# Altium schematic sheet [3]Sensors.SchDoc
size A4
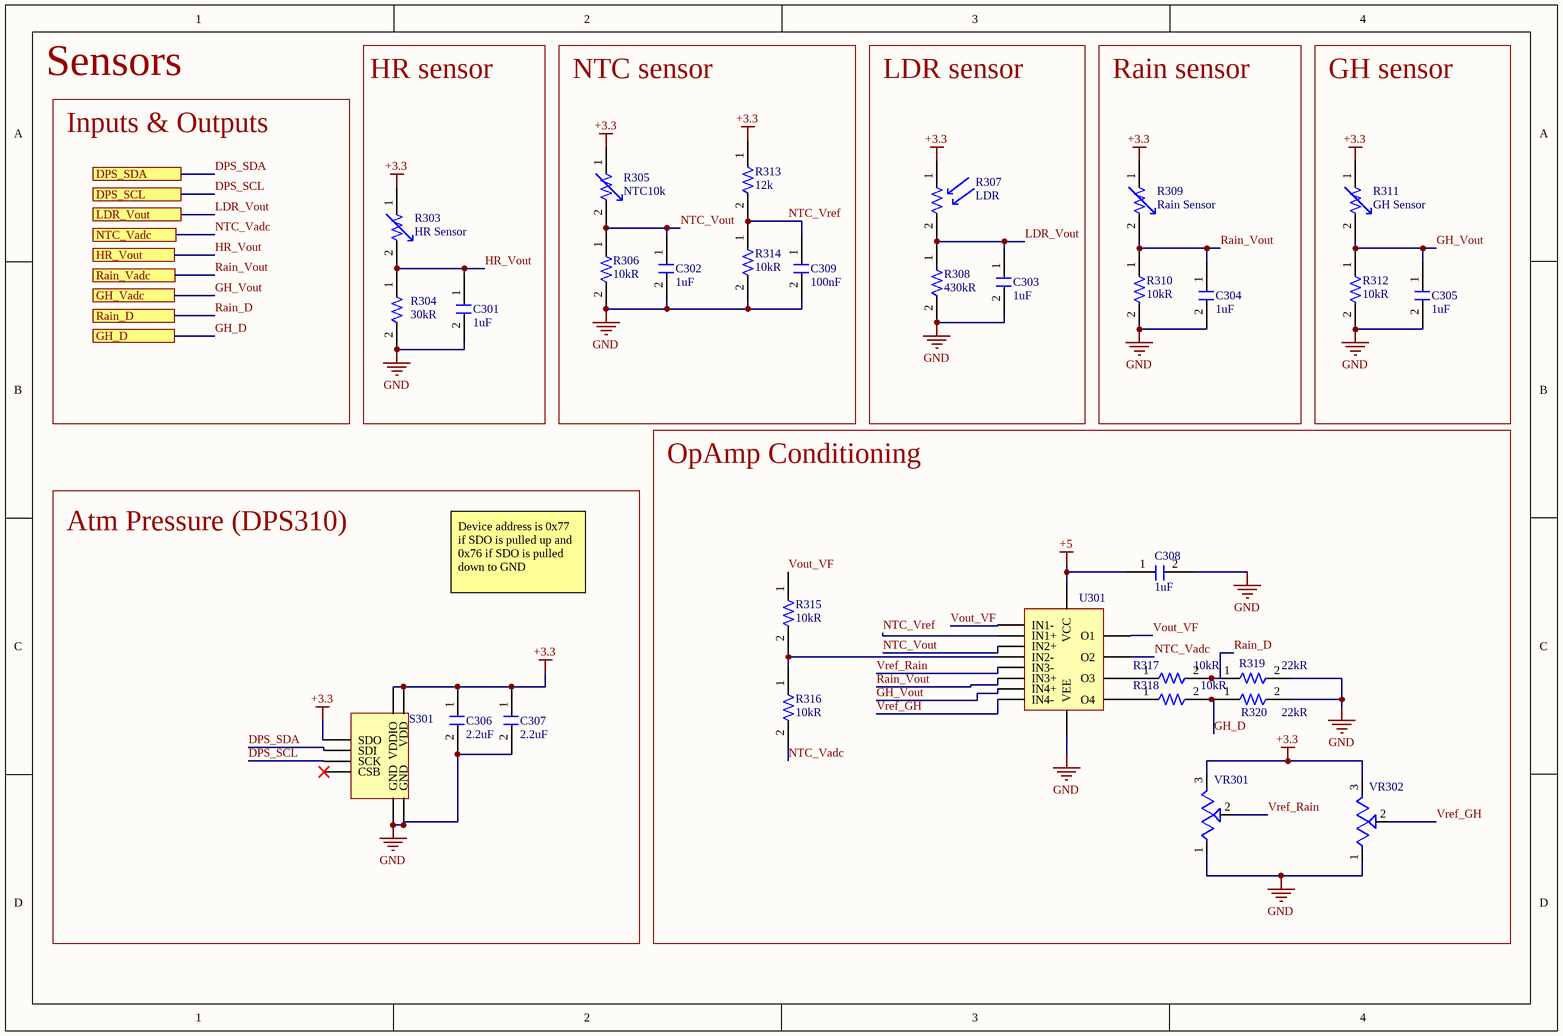
[diagram p0: [3]Sensors.SchDoc]

## Parts
C301  Capacitance: 1uF  [C1206FNPC-RW]  (hidden comment: 885012208036)
C302  Capacitance: 1uF  [C1206FNPC-RW]  (hidden comment: 885012208036)
C303  Capacitance: 1uF  [C1206FNPC-RW]  (hidden comment: 885012208036)
C304  Capacitance: 1uF  [C1206FNPC-RW]  (hidden comment: 885012208036)
C305  Capacitance: 1uF  [C1206FNPC-RW]  (hidden comment: 885012208036)
C306  2.2uF  [C0805FNPC-W]
C307  2.2uF  [C0805FNPC-W]
C308  Capacitance: 1uF  [C1206FNPC-RW]  (hidden comment: 885012208036)
C309  Capacitance: 100nF  [C1206FNPC-RW]  (hidden comment: 885012208009)
R303  HR Sensor  [HR_Sensor]
R304  Resistance: 30kR  [R1206FTK-W]  (hidden comment: CRCW120630K0FKEA)
R305  NTC10k  [NTC10k_0805]
R306  Resistance: 10kR  [R0805FTK]  (hidden comment: CR0805-JW-103ELF)
R307  LDR  [HR_Sensor]
R308  430kR  [R0805FTK]
R309  Rain Sensor  [EXTERNAL_SENSOR]
R310  Resistance: 10kR  [R0805FTK]  (hidden comment: CR0805-JW-103ELF)
R311  GH Sensor  [EXTERNAL_SENSOR]
R312  Resistance: 10kR  [R0805FTK]  (hidden comment: CR0805-JW-103ELF)
R313  12k  [R1206]
R314  Resistance: 10kR  [R0805FTK]  (hidden comment: CR0805-JW-103ELF)
R315  Resistance: 10kR  [R0805FTK]  (hidden comment: CR0805-JW-103ELF)
R316  Resistance: 10kR  [R0805FTK]  (hidden comment: CR0805-JW-103ELF)
R317  Resistance: 10kR  [R0805FTK]  (hidden comment: CR0805-JW-103ELF)
R318  Resistance: 10kR  [R0805FTK]  (hidden comment: CR0805-JW-103ELF)
R319  22kR  [R0805FTK]
R320  22kR  [R0805FTK]
S301  DPS310XTSA1  [XDCR_DPS310XTSA1]  (value not drawn)
U301  OpAmp  [LM324_OpAmp]  (value not drawn)
VR301  Trimmer_10k_THT  [TRIM_3362P-1-103LF]  (value not drawn)
VR302  Trimmer_10k_THT  [TRIM_3362P-1-103LF]  (value not drawn)

## Blocks framed on the sheet
HR sensor: C301 R303 R304
NTC sensor: C302 C309 R305 R306 R313 R314
LDR sensor: C303 R307 R308
Rain sensor: C304 R309 R310
GH sensor: C305 R311 R312
OpAmp Conditioning: C308 R315-R320 U301 VR301 VR302
Atm Pressure (DPS310): C306 C307 S301

## Ports
DPS_SCL, DPS_SDA, GH_D, GH_Vadc, HR_Vout, LDR_Vout, NTC_Vadc, Rain_D, Rain_Vadc

## Nets
+3.3: C306.1 C307.1 R303.1 R305.1 R307.1 R309.1 R311.1 R313.1 S301.5(SDO) S301.6(VDDIO) S301.8(VDD) VR301.3(CW) VR302.3(CW)
+5: C308.1 U301.4(VCC)
GND: C301.2 C302.2 C303.2 C304.2 C305.2 C306.2 C307.2 C308.2 C309.2 R304.2 R306.2 R308.2 R310.2 R312.2 R314.2 R319.2 R320.2 S301.1(GND) S301.7(GND) U301.11(VEE) VR301.1(CCW) VR302.1(CCW)
DPS_SCL: S301.4(SCK) ; port DPS_SCL
DPS_SDA: S301.3(SDI) ; port DPS_SDA
GH_D: R318.2 R320.1 ; port GH_D
GH_Vout: C305.1 R311.2 R312.1 U301.12(IN4+) ; port GH_Vadc
HR_Vout: C301.1 R303.2 R304.1 ; port HR_Vout
LDR_Vout: C303.1 R307.2 R308.1 ; port LDR_Vout
NTC_Vadc: R316.2 U301.7(O2) ; port NTC_Vadc
NTC_Vout: C302.1 R305.2 R306.1 U301.5(IN2+)
NTC_Vref: C309.1 R313.2 R314.1 U301.3(IN1+)
Rain_D: R317.2 R319.1 ; port Rain_D
Rain_Vout: C304.1 R309.2 R310.1 U301.10(IN3+) ; port Rain_Vadc
Vout_VF: R315.1 U301.1(O1) U301.2(IN1-)
Vref_GH: U301.13(IN4-) VR302.2(WIPER)
Vref_Rain: U301.9(IN3-) VR301.2(WIPER)
NetR315_2: R315.2 R316.1 U301.6(IN2-)
NetR317_1: R317.1 U301.8(O3)
NetR318_1: R318.1 U301.14(O4)

Not connected (* = marked no-connect by the designer): S301 2(CSB)*

## Notes on the sheet
- Sensors
- Inputs & Outputs
- Device address is 0x77 if SDO is pulled up and 0x76 if SDO is pulled down to GND

## Library data of the parts
C301-C305 C308 = C1u-16V-1206FNPC-X7R: Cap Cer 1UF 16V X7R 1206; Manufacturer: Wurth Electronics; Tolerance: 10%; .Creator: GP; Category: Capacitor; ComponentLink1Description: Datasheet; ComponentLink1URL: https://www.we-online.com/catalog/datasheet/885012208036.pdf; ComponentLink2Description: Where buy it; ComponentLink2URL: https://www.we-online.com/catalog/en/WCAP-CSGP-16VDC#885012208036; Supplier 1: Mouser; Manufacturer Part Number: 885012208036; RoHS: Yes; Stock 1: 5938; Pricing 1: 1=0,15000, 10=0,13900, 50=0,13900, 100=0,12400, 500=0,11000, 1000=0,11000, 3000=0,09100, 10000=0,09100 (USD); Mount: Surface Mount; Case/Package: 1206; Case Code (Metric): 3216; Case Code (Imperial): 1206; Min Operating Temperature: -55°C; Max Operating Temperature: 125°C; Packaging: Tape and Reel; Voltage Rating: 16V; Length: 0.126inch; Width: 0.063inch; Thickness: 0.051inch; RoHS Compliant: Yes; Supplier Part Number 1: 710-885012208036
C306 C307 = C2.2u-16V-0805FTK
C309 = C100n-10V-1206FNPC-X7R: Cap, 0.1ΜF, 10V, 10%, X7R, 1206; Manufacturer 1: Wurth Electronics; .Creator: GP; Supplier 1: Digi-Key; Manufacturer Part Number 1: 885012208009; RoHS: Yes; Category: Ceramic Capacitors; Stock 1: 7198; Pricing 1: 1=0,11000, 10=0,10300, 100=0,09200, 500=0,08100 (USD); Mount: Surface Mount; Case/Package: 1206; Case Code (Metric): 3216; Case Code (Imperial): 1206; Min Operating Temperature: -55°C; Max Operating Temperature: 125°C; Packaging: Tape and Reel; Voltage Rating: 10V; Tolerance: 10%; Length: 0.126inch; Width: 0.063inch; Thickness: 0.035inch; RoHS Compliant: Yes; ComponentLink1URL: http://www.farnell.com/datasheets/2031891.pdf?src-supplier=Farnell; ComponentLink1Description: http://www.farnell.com/datasheets/2031891.pdf?src-supplier=Farnell; ComponentLink2URL: http://katalog.we-online.de/pbs/datasheet/885012208009.pdf?src-supplier=Digi-Key; ComponentLink2Description: http://katalog.we-online.de/pbs/datasheet/885012208009.pdf?src-supplier=Digi-Key; ComponentLink3URL: https://katalog.we-online.de/pbs/datasheet/885012208009.pdf?src-supplier=Digi-Key; ComponentLink3Description: https://katalog.we-online.de/pbs/datasheet/885012208009.pdf?src-supplier=Digi-Key; Supplier Part Number 1: 732-8086-1-ND; ComponentLink4Description: Wurth Elektronik; ComponentLink4URL: https://www.we-online.com/catalog/en/WCAP-CSGP-10VDC?sq=885012208009#885012208009
R303 = Resistive_HR_Sensor: Resistive HR Sensor. R30k at 60%@25ºC
R304 = R30k-1206FTK: Res Thick Film 1206 30K Ohm 1% 1/4W ±100ppm/°C Molded SMD SMD Paper T/R; Manufacturer: Vishay; Power Rating: 250mW; Voltage Rating: 200V; .Creator: GP; Category: Resistor; ComponentLink1Description: Datasheet; ComponentLink1URL: https://docs.rs-online.com/bca8/A700000006404581.pdf; ComponentLink2Description: Where buy it; ComponentLink2URL: https://es.rs-online.com/web/p/resistencias-de-montaje-en-superficie/6792039; Supplier 1: RSComponents; Manufacturer Part Number: CRCW120630K0FKEA; RoHS: Yes; Stock 1: 3550; Pricing 1: 50=0,12000, 500=0,11200, 1000=0,10400, 2000=0,09700, 4000=0,08900 (USD); Case/Package: 1206; Number of Pins: 2; Contact Plating: Tin; Case Code (Imperial): 1206; Case Code (Metric): 3216; Weight: 0.000353oz; Size Code: 1206; Min Operating Temperature: -55°C; Max Operating Temperature: 155°C; Tolerance: 1%; Resistor Type: Thick Film; Packaging: Tape and Reel; Temperature Coefficient: 100ppm/°C; Package Quantity: 10; Termination: SMD/SMT; Number of Terminations: 2; Max Power Dissipation: 250mW; Features: Automotive AEC-Q200; Series: CRCW; Construction: Rectangular; Resistance Tolerance: 1%; Technology: THICK FILM; Length: 3.2mm; Width: 1.6mm; Height: 0.55mm; Depth: 1.6mm; Radiation Hardening: No; RoHS Compliant: Yes; REACH SVHC: Unknown; Military Standard: Not; Supplier Part Number 1: 6792039
R305 = NTC_10k_0805
R306 R310 R312 R314-R318 = R10k-0805FTK: BOURNS         CR0805-JW-103ELF            Surface Mount Chip Resistor, Thick Film, CR Series, 10 kohm, 125 mW,  5%, 150 V; Temperature Coefficient: 200ppm/°C; Power Rating: 125mW; Voltage Rating: 150V; Voltage Rating (DC): 100V; .Creator: DR; Supplier 1: Arrow Electronics; Manufacturer 1: Bourns; Manufacturer Part Number 1: CR0805-JW-103ELF; RoHS: Yes; Category: Chip SMD Resistors; Stock 1: 57566; Pricing 1: 1=0,05790, 10=0,01540, 25=0,01340, 100=0,00340 (USD); Mount: Surface Mount; Case/Package: 0805; Number of Pins: 2; Contact Plating: Tin; Case Code (Metric): 2012; Case Code (Imperial): 0805; Min Operating Temperature: -55°C; Max Operating Temperature: 155°C; Tolerance: 5%; Resistor Type: Thick Film; Package Quantity: 1; Packaging: Tape and Reel; Number of Terminations: 2; Termination: SMD/SMT; Max Power Dissipation: 125mW; Features: Moisture Resistant; Series: CR0805; Construction: Rectangular; Resistance Tolerance: 5%; Technology: THICK FILM; Length: 2mm; Width: 1.25mm; Height: 0.5mm; Depth: 1.25mm; Thickness: 508um; Radiation Hardening: No; REACH SVHC: No SVHC; Military Standard: Not; RoHS Compliant: Yes; ComponentLink1URL: https://datasheet.ciiva.com/11821/0900766b80fcdb72-11821135.pdf?src-supplier=RSComponents; ComponentLink1Description: https://datasheet.ciiva.com/11821/0900766b80fcdb72-11821135.pdf?src-supplier=RSComponents; ComponentLink2URL: https://datasheet.ciiva.com/9122/chpreztr-9122374.pdf?src-supplier=Avnet; ComponentLink2Description: https://datasheet.ciiva.com/9122/chpreztr-9122374.pdf?src-supplier=Avnet; ComponentLink3URL: https://datasheet.ciiva.com/22693/1902866-22693254.pdf?src-supplier=Element14; ComponentLink3Description: https://datasheet.ciiva.com/22693/1902866-22693254.pdf?src-supplier=Element14; ComponentLink4URL: https://datasheet.ciiva.com/7986/691949-7986187.pdf?src-supplier=Element14; ComponentLink4Description: https://datasheet.ciiva.com/7986/691949-7986187.pdf?src-supplier=Element14; ComponentLink5URL: https://datasheet.ciiva.com/30065/159chpreztr-30065976.pdf?src-supplier=Onlinecomponents.com; ComponentLink5Description: https://datasheet.ciiva.com/30065/159chpreztr-30065976.pdf?src-supplier=Onlinecomponents.com; ComponentLink6URL: https://datasheet.ciiva.com/16783/70154685-16783482.pdf?src-supplier=Allied+Electronics; ComponentLink6Description: https://datasheet.ciiva.com/16783/70154685-16783482.pdf?src-supplier=Allied+Electronics; ComponentLink7URL: https://datasheet.ciiva.com/5548/chpreztr-5548491.pdf?src-supplier=Mouser; ComponentLink7Description: https://datasheet.ciiva.com/5548/chpreztr-5548491.pdf?src-supplier=Mouser; ComponentLink8URL: https://datasheet.ciiva.com/6559/chpreztr-6559900.pdf?src-supplier=Digi-Key; ComponentLink8Description: https://datasheet.ciiva.com/6559/chpreztr-6559900.pdf?src-supplier=Digi-Key; ComponentLink9URL: https://datasheet.ciiva.com/6559/chpreztr-6559901.pdf?src-supplier=Digi-Key; ComponentLink9Description: https://datasheet.ciiva.com/6559/chpreztr-6559901.pdf?src-supplier=Digi-Key; ComponentLink10URL: https://datasheet.ciiva.com/7985/1856384-7985869.pdf?src-supplier=Element14; ComponentLink10Description: https://datasheet.ciiva.com/7985/1856384-7985869.pdf?src-supplier=Element14; ComponentLink11URL: https://datasheet.ciiva.com/48692/001055517-da-01-en-smd-wid-cr0805-jw-103elf-10k-ohm-1-8w-48692118.pdf?src-supplier=Conrad; ComponentLink11Description: https://datasheet.ciiva.com/48692/001055517-da-01-en-smd-wid-cr0805-jw-103elf-10k-ohm-1-8w-48692118.pdf?src-supplier=Conrad; Supplier Part Number 1: CR0805-JW-103ELF
R307 = LDR_LightSensor
R308 = R430k-0805FTK
R309 = RainSensor_Resisitve
R311 = GH_Resistive_Sensor
R313 = R12k-1206
R319 R320 = R22k-0805FTK
S301 = AtmPressureSensor_DPS310XTSA1: DPS310 Digital Pressure Sensor
U301 = LM324_OpAmp
VR301 VR302 = Trimmer_10k_THT: Trimmer, Cermet, Rest 10 Kilohms, PCB, 1 Turns, Pwr-Rtg 0.5 W, Tol 10% | Bourns 3362P-1-103LF; SnapEDA_Link: https://www.snapeda.com/parts/3362P-1-103LF/Bourns/view-part/?ref=snap; Package: 3362P-1 Bourns Inc.; Value: *; MF: Bourns; MP: 3362P-1-103LF; Check_prices: https://www.snapeda.com/parts/3362P-1-103LF/Bourns/view-part/?ref=eda